# EasyEDA Pro project ProPrj_微机Lab8示意_2025-11-21.epro

# Schematic Schematic1
Board Name: Board1; Create Date: 2025-11-20; Page Name: P1; Project Name: 微机Lab8示意; Schematic Name: Schematic1; Update Date: 2025-11-21; Company: 嘉立创EDA; Page Size: A4; Version: V1.0
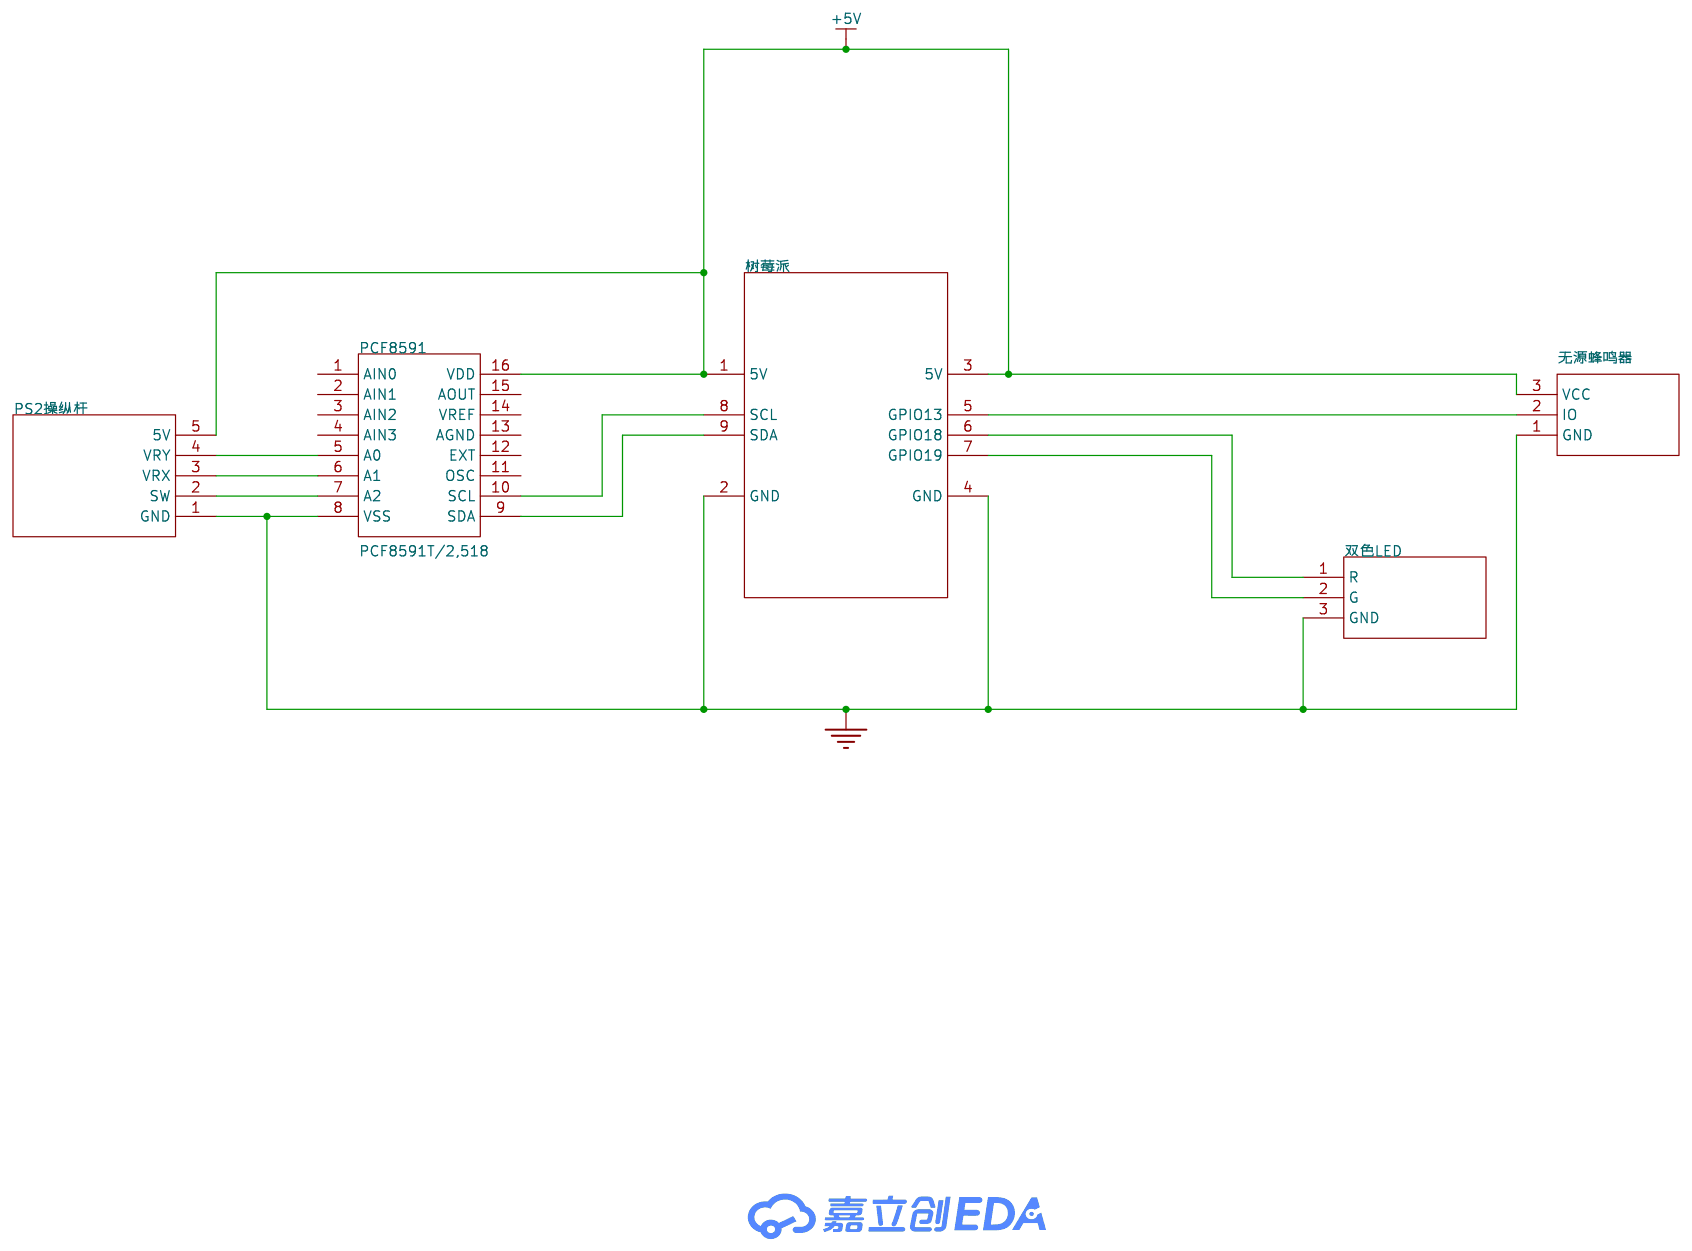
[diagram p0: schematic sheet]

## Parts
PCF8591  PCF8591T/2,518  [SOIC-16_L10.3-W7.5-P1.27-LS10.3-BL]
PS2操纵杆  -
双色LED  -
无源蜂鸣器  -
树莓派  -

## Library data of the parts
PCF8591 = PCF8591T/2,518: LCSC Part Name: PCF8591T/2,518 停产; Supplier Part: C8366; Manufacturer: NXP(恩智浦); Supplier Footprint: SOIC-16-300mil; JLCPCB Part Class: 扩展库; Supplier: LCSC
PS2操纵杆 = 操纵杆示意图
双色LED = 双色LED示意
无源蜂鸣器 = 无源蜂鸣器示意图
树莓派 = 树莓派示意图

## Nets
+5V: PCF8591.16(VDD) PS2操纵杆.5(5V) 无源蜂鸣器.3(VCC) 树莓派.1(5V) 树莓派.3(5V)
GND: PCF8591.8(VSS) PS2操纵杆.1(GND) 双色LED.3(GND) 无源蜂鸣器.1(GND) 树莓派.2(GND) 树莓派.4(GND)
Net-(PCF8591-5): PCF8591.5(A0) PS2操纵杆.4(VRY)
Net-(PCF8591-6): PCF8591.6(A1) PS2操纵杆.3(VRX)
Net-(PCF8591-7): PCF8591.7(A2) PS2操纵杆.2(SW)
Net-(PCF8591-9): PCF8591.9(SDA) 树莓派.9(SDA)
Net-(PCF8591-10): PCF8591.10(SCL) 树莓派.8(SCL)
Net-(双色LED-1): 双色LED.1(R) 树莓派.6(GPIO18)
Net-(双色LED-2): 双色LED.2(G) 树莓派.7(GPIO19)
Net-(无源蜂鸣器-2): 无源蜂鸣器.2(IO) 树莓派.5(GPIO13)

Not connected (* = marked no-connect by the designer): PCF8591 1(AIN0) 2(AIN1) 3(AIN2) 4(AIN3) 11(OSC) 12(EXT) 13(AGND) 14(VREF) 15(AOUT)
